# EAGLE schematic CAA-NMC-2-panels (EAGLE 9.2.2)
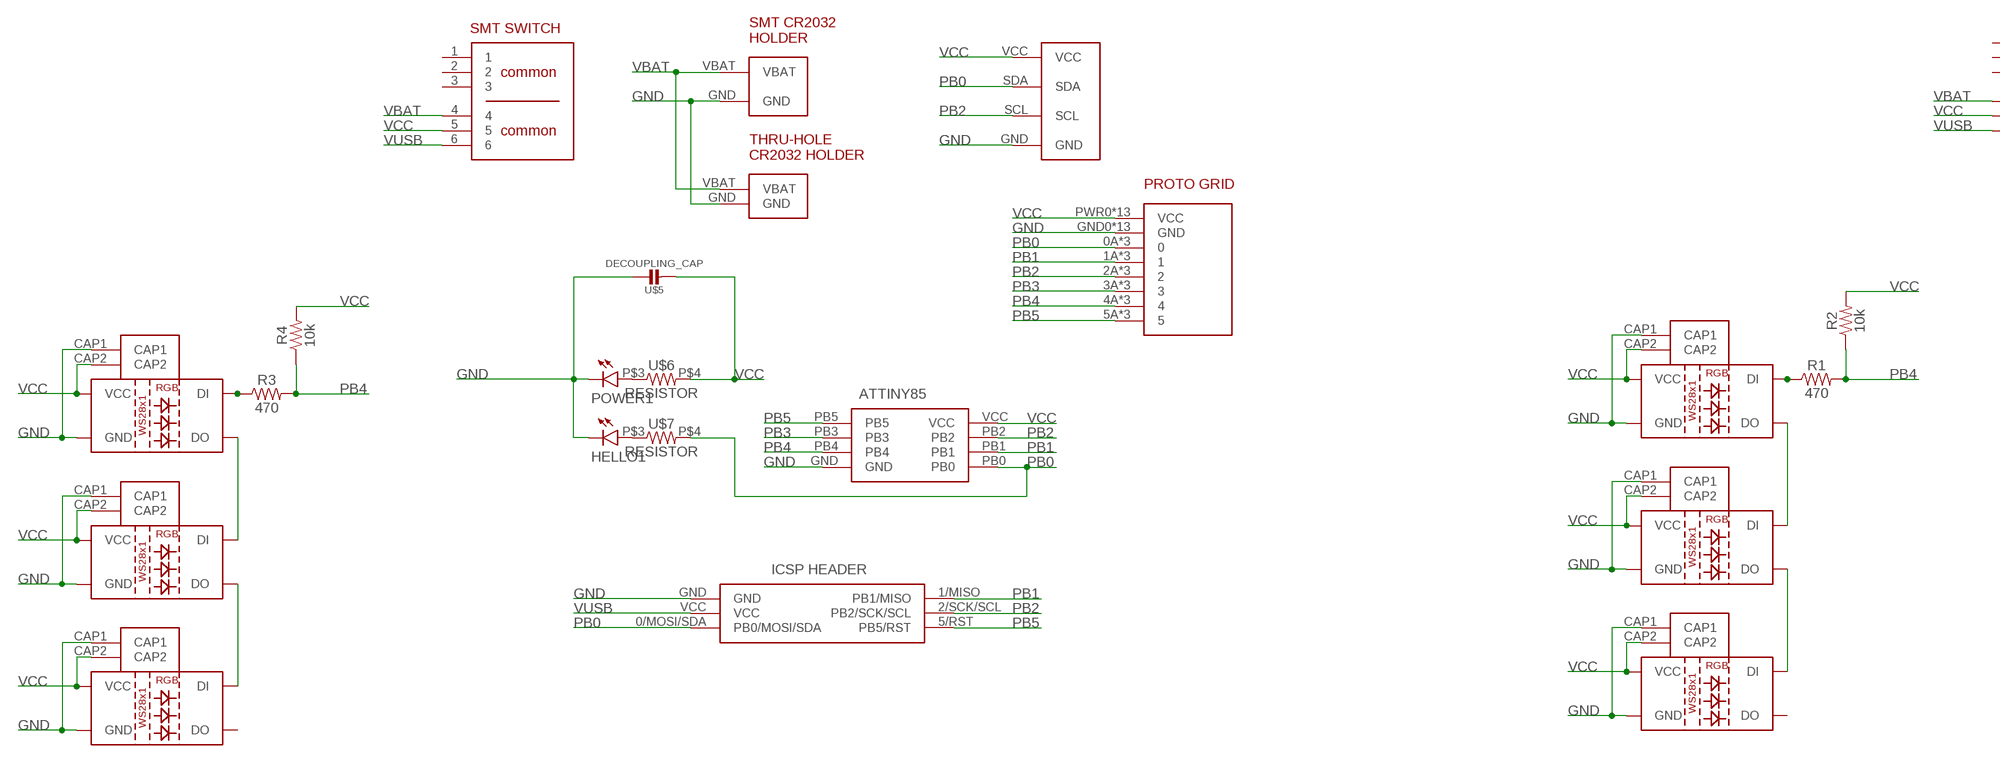
[diagram p0: schematic, sheet 1, part 1 of 2]
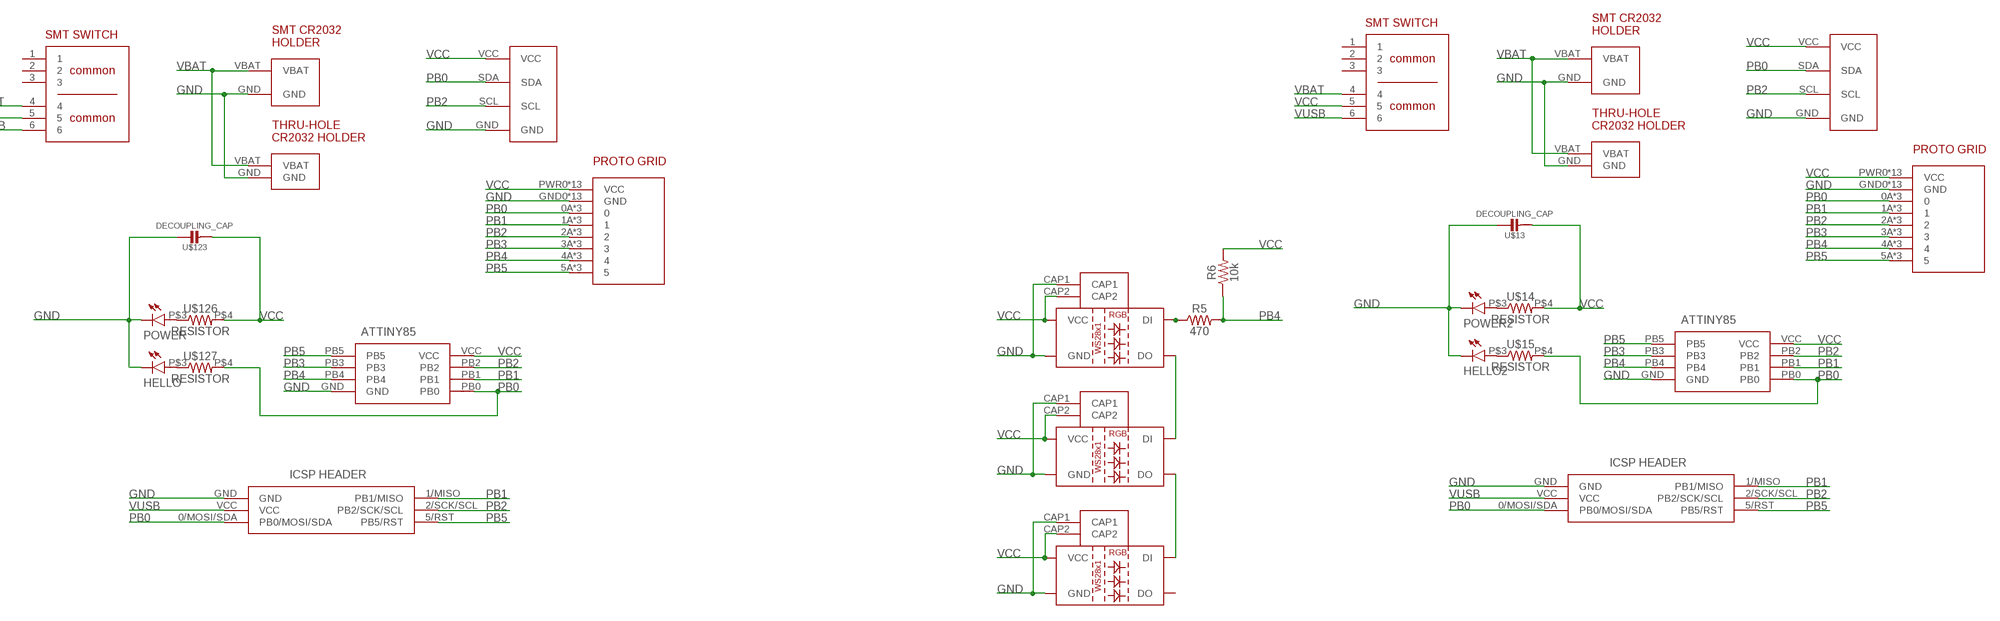
[diagram p1: schematic, sheet 1, part 2 of 2]

## Parts
D1  WS2812B  [WS2812B]
D2  WS2812B  [WS2812B]
D3  WS2812B  [WS2812B]
D4  WS2812B  [WS2812B]
D5  WS2812B  [WS2812B]
D6  WS2812B  [WS2812B]
D7  WS2812B  [WS2812B]
D8  WS2812B  [WS2812B]
D9  WS2812B  [WS2812B]
HELLO  LED3MM  [LED3MM]
HELLO1  LED3MM  [LED3MM]
HELLO2  LED3MM  [LED3MM]
IC1  ATTINY85-20SU  [SOT127P798X216-8N]
IC2  ATTINY85-20SU  [SOT127P798X216-8N]
IC3  ATTINY85-20SU  [SOT127P798X216-8N]
J1  M20-9980346  [HDRV6W64P254_2X3_762X508X868P]
J2  M20-9980346  [HDRV6W64P254_2X3_762X508X868P]
J3  M20-9980346  [HDRV6W64P254_2X3_762X508X868P]
POWER  LED3MM  [LED3MM]
POWER1  LED3MM  [LED3MM]
POWER2  LED3MM  [LED3MM]
R1  470  470OHM-0603-1/10W-1%  [0603]
R2  10k  10KOHM-0603-1/10W-1%  [0603]
R3  470  470OHM-0603-1/10W-1%  [0603]
R4  10k  10KOHM-0603-1/10W-1%  [0603]
R5  470  470OHM-0603-1/10W-1%  [0603]
R6  10k  10KOHM-0603-1/10W-1%  [0603]
U$1  PROTO  [PROTO]
U$2  SMT-BATTERY-HOLDER  [SMT-CR-HOLDER]
U$3  THRU-CR-HOLDER  [THRU-CR-HOLDER]
U$4  I2C-PADS  [I2C-PADS]
U$5  DECOUPLING_CAP  [DECOUPLING_CAP]
U$6  RESISTOR  [AXIAL-0.3]
U$7  RESISTOR  [AXIAL-0.3]
U$8  SMT-SWITCH  [SMT-SWITCH]
U$9  PROTO  [PROTO]
U$10  SMT-BATTERY-HOLDER  [SMT-CR-HOLDER]
U$11  THRU-CR-HOLDER  [THRU-CR-HOLDER]
U$12  I2C-PADS  [I2C-PADS]
U$13  DECOUPLING_CAP  [DECOUPLING_CAP]
U$14  RESISTOR  [AXIAL-0.3]
U$15  RESISTOR  [AXIAL-0.3]
U$16  SMT-SWITCH  [SMT-SWITCH]
U$17  PROTO  [PROTO]
U$18  SMT-BATTERY-HOLDER  [SMT-CR-HOLDER]
U$19  THRU-CR-HOLDER  [THRU-CR-HOLDER]
U$20  I2C-PADS  [I2C-PADS]
U$123  DECOUPLING_CAP  [DECOUPLING_CAP]
U$126  RESISTOR  [AXIAL-0.3]
U$127  RESISTOR  [AXIAL-0.3]
U$145  SMT-SWITCH  [SMT-SWITCH]

## Nets
GND [GND]: D1.CAP1 D1.GND D2.CAP1 D2.GND D3.CAP1 D3.GND D4.CAP1 D4.GND D5.CAP1 D5.GND D6.CAP1 D6.GND D7.CAP1 D7.GND D8.CAP1 D8.GND D9.CAP1 D9.GND HELLO1.NEG HELLO2.NEG HELLO.NEG IC1.GND IC2.GND IC3.GND J1.GND J2.GND J3.GND POWER1.NEG POWER2.NEG POWER.NEG U$1.GND0(GND) U$1.GND1(GND) U$1.GND2(GND) U$1.GND3(GND) U$1.GND4(GND) U$1.GND5(GND) U$1.GND6(GND) U$1.GND7(GND) U$1.GND8(GND) U$1.GND9(GND) U$1.GND10(GND) U$1.GND11(GND) U$1.GND12(GND) U$2.GND U$3.GND U$4.GND U$5.P$1 U$9.GND0(GND) U$9.GND1(GND) U$9.GND2(GND) U$9.GND3(GND) U$9.GND4(GND) U$9.GND5(GND) U$9.GND6(GND) U$9.GND7(GND) U$9.GND8(GND) U$9.GND9(GND) U$9.GND10(GND) U$9.GND11(GND) U$9.GND12(GND) U$10.GND U$11.GND U$12.GND U$13.P$1 U$17.GND0(GND) U$17.GND1(GND) U$17.GND2(GND) U$17.GND3(GND) U$17.GND4(GND) U$17.GND5(GND) U$17.GND6(GND) U$17.GND7(GND) U$17.GND8(GND) U$17.GND9(GND) U$17.GND10(GND) U$17.GND11(GND) U$17.GND12(GND) U$18.GND U$19.GND U$20.GND U$123.P$1
N$1: POWER.POS U$126.P$3
N$2: HELLO.POS U$127.P$3
N$3: D1.DO D2.DI
N$4: D2.DO D3.DI
N$5: D1.DI R1.1
N$6: POWER1.POS U$6.P$3
N$7: HELLO1.POS U$7.P$3
N$8: D4.DO D5.DI
N$9: D5.DO D6.DI
N$10: D4.DI R3.1
N$11: POWER2.POS U$14.P$3
N$12: HELLO2.POS U$15.P$3
N$13: D7.DO D8.DI
N$14: D8.DO D9.DI
N$15: D7.DI R5.1
PB0: IC1.PB0 IC2.PB0 IC3.PB0 J1.0/MOSI/SDA(PB0/MOSI/SDA) J2.0/MOSI/SDA(PB0/MOSI/SDA) J3.0/MOSI/SDA(PB0/MOSI/SDA) U$1.0A U$1.0B U$1.0C U$4.SDA U$7.P$4 U$9.0A U$9.0B U$9.0C U$12.SDA U$15.P$4 U$17.0A U$17.0B U$17.0C U$20.SDA U$127.P$4
PB1: IC1.PB1 IC2.PB1 IC3.PB1 J1.1/MISO(PB1/MISO) J2.1/MISO(PB1/MISO) J3.1/MISO(PB1/MISO) U$1.1A U$1.1B U$1.1C U$9.1A U$9.1B U$9.1C U$17.1A U$17.1B U$17.1C
PB2: IC1.PB2 IC2.PB2 IC3.PB2 J1.2/SCK/SCL(PB2/SCK/SCL) J2.2/SCK/SCL(PB2/SCK/SCL) J3.2/SCK/SCL(PB2/SCK/SCL) U$1.2A U$1.2B U$1.2C U$4.SCL U$9.2A U$9.2B U$9.2C U$12.SCL U$17.2A U$17.2B U$17.2C U$20.SCL
PB3: IC1.PB3 IC2.PB3 IC3.PB3 U$1.3A U$1.3B U$1.3C U$9.3A U$9.3B U$9.3C U$17.3A U$17.3B U$17.3C
PB4: IC1.PB4 IC2.PB4 IC3.PB4 R1.2 R2.1 R3.2 R4.1 R5.2 R6.1 U$1.4A U$1.4B U$1.4C U$9.4A U$9.4B U$9.4C U$17.4A U$17.4B U$17.4C
PB5: IC1.PB5 IC2.PB5 IC3.PB5 J1.5/RST(PB5/RST) J2.5/RST(PB5/RST) J3.5/RST(PB5/RST) U$1.5A U$1.5B U$1.5C U$9.5A U$9.5B U$9.5C U$17.5A U$17.5B U$17.5C
VBAT [VBAT]: U$2.VBAT U$3.VBAT U$8.4 U$10.VBAT U$11.VBAT U$16.4 U$18.VBAT U$19.VBAT U$145.4
VCC [VCC]: D1.CAP2 D1.VCC D2.CAP2 D2.VCC D3.CAP2 D3.VCC D4.CAP2 D4.VCC D5.CAP2 D5.VCC D6.CAP2 D6.VCC D7.CAP2 D7.VCC D8.CAP2 D8.VCC D9.CAP2 D9.VCC IC1.VCC IC2.VCC IC3.VCC R2.2 R4.2 R6.2 U$1.PWR0(VCC) U$1.PWR1(VCC) U$1.PWR2(VCC) U$1.PWR3(VCC) U$1.PWR4(VCC) U$1.PWR5(VCC) U$1.PWR6(VCC) U$1.PWR7(VCC) U$1.PWR8(VCC) U$1.PWR9(VCC) U$1.PWR10(VCC) U$1.PWR11(VCC) U$1.PWR12(VCC) U$4.VCC U$5.P$2 U$6.P$4 U$8.5 U$9.PWR0(VCC) U$9.PWR1(VCC) U$9.PWR2(VCC) U$9.PWR3(VCC) U$9.PWR4(VCC) U$9.PWR5(VCC) U$9.PWR6(VCC) U$9.PWR7(VCC) U$9.PWR8(VCC) U$9.PWR9(VCC) U$9.PWR10(VCC) U$9.PWR11(VCC) U$9.PWR12(VCC) U$12.VCC U$13.P$2 U$14.P$4 U$16.5 U$17.PWR0(VCC) U$17.PWR1(VCC) U$17.PWR2(VCC) U$17.PWR3(VCC) U$17.PWR4(VCC) U$17.PWR5(VCC) U$17.PWR6(VCC) U$17.PWR7(VCC) U$17.PWR8(VCC) U$17.PWR9(VCC) U$17.PWR10(VCC) U$17.PWR11(VCC) U$17.PWR12(VCC) U$20.VCC U$123.P$2 U$126.P$4 U$145.5
VUSB: J1.VCC J2.VCC J3.VCC U$8.6 U$16.6 U$145.6
Unconnected: D3.DO D6.DO D9.DO U$8.1 U$8.2 U$8.3 U$16.1 U$16.2 U$16.3 U$145.1 U$145.2 U$145.3

## Library data of the parts
D1-D9 = BadgeParts:WS2812B: WS2812B SMD addressable RGB LED 5x5mm SMD LED with built-in controller IC. Color: Red/Green/Blue mC Rating: RGB: 390, 660, 180 mcd Forward Voltage: RGB: 2.0, 3.0, 3.0 V Packages:WS2812B SparkFun Products: Blynk Board - ESP8266 <https://www.sparkfun.com/products/13794>; PROD_ID: DIO-12503
HELLO HELLO1 HELLO2 POWER POWER1 POWER2 = BadgeParts:LED3MM
IC1-IC3 = BadgeParts:ATTINY85-20SU: MICROCHIP - ATTINY85-20SU - MICROCONTROLLER MCU, 8 BIT, ATTINY, 20MHZ, SOIC-8 Source: Datasheet <https://componentsearchengine.com/Datasheets/2/ATTINY85-20SU.pdf>; ARROW_PART_NUMBER: ATTINY85-20SU; ARROW_PRICE/STOCK: https://www.arrow.com/en/products/attiny85-20su/microchip-technology; DESCRIPTION: MICROCHIP - ATTINY85-20SU - MICROCONTROLLER MCU, 8 BIT, ATTINY, 20MHZ, SOIC-8; HEIGHT: 2.16mm; MANUFACTURER_NAME: Microchip; MANUFACTURER_PART_NUMBER: ATTINY85-20SU; RS_PART_NUMBER: 1331674; RS_PRICE/STOCK: http://uk.rs-online.com/web/p/products/1331674
J1-J3 = BadgeParts:M20-9980346: 03+03 DIL Vertical Pin Header HARWIN M20 Series, 2.54mm Pitch 6 Way 2 Row Straight PCB Header, Solder Termination, 3A Source: Datasheet <https://cdn.harwin.com/pdfs/M20-998.pdf?utm_source=3D_PDF&utm_medium=3D_PDF&utm_campaign=3D_PDF>; ARROW_PART_NUMBER: M20-9980346; ARROW_PRICE/STOCK: http://uk.rs-online.com/web/p/products/7457046P; DESCRIPTION: 03+03 DIL Vertical Pin Header HARWIN M20 Series, 2.54mm Pitch 6 Way 2 Row Straight PCB Header, Solder Termination, 3A; HEIGHT: 8.68mm; MANUFACTURER_NAME: HARWIN; MANUFACTURER_PART_NUMBER: M20-9980346; RS_PART_NUMBER: 7457046P; RS_PRICE/STOCK: http://uk.rs-online.com/web/p/products/7457046P
R1 R3 R5 = SparkFun-Resistors:470OHM: 470Ω resistor A resistor is a passive two-terminal electrical component that implements electrical resistance as a circuit element. Resistors act to reduce current flow, and, at the same time, act to lower voltage levels within circuits. - Wikipedia; PROD_ID: RES-07869
R2 R4 R6 = SparkFun-Resistors:10KOHM: 10kΩ resistor A resistor is a passive two-terminal electrical component that implements electrical resistance as a circuit element. Resistors act to reduce current flow, and, at the same time, act to lower voltage levels within circuits. - Wikipedia; PROD_ID: RES-00824
U$1 U$9 U$17 = BadgeParts:PROTO
U$2 U$10 U$18 = BadgeParts:SMT-BATTERY-HOLDER
U$3 U$11 U$19 = BadgeParts:THRU-CR-HOLDER
U$4 U$12 U$20 = BadgeParts:I2C-PADS
U$5 U$13 U$123 = BadgeParts:DECOUPLING_CAP
U$6 U$7 U$14 U$15 U$126 U$127 = BadgeParts:RESISTOR
U$8 U$16 U$145 = BadgeParts:SMT-SWITCH

## Net classes
0 default: width 0.254 mm, clearance 0.254 mm
1 VCC: width 0.381 mm, clearance 0.254 mm
2 GND: width 0.381 mm, clearance 0.254 mm
3 VBAT: width 0.381 mm, clearance 0.254 mm